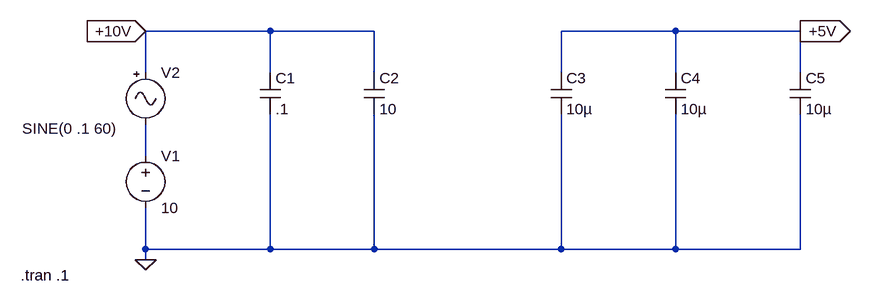
[diagram p0: schematic regulator.asc]
regulator.asc, the LTspice schematic file:
Version 4
SHEET 1 1132 680
WIRE 192 -80 0 -80
WIRE 352 -80 192 -80
WIRE 816 -80 640 -80
WIRE 1008 -80 816 -80
WIRE 0 -16 0 -80
WIRE 192 -16 192 -80
WIRE 352 -16 352 -80
WIRE 640 -16 640 -80
WIRE 816 -16 816 -80
WIRE 1008 -16 1008 -80
WIRE 0 112 0 64
WIRE 0 256 0 192
WIRE 192 256 192 48
WIRE 192 256 0 256
WIRE 352 256 352 48
WIRE 352 256 192 256
WIRE 640 256 640 48
WIRE 640 256 352 256
WIRE 816 256 816 48
WIRE 816 256 640 256
WIRE 1008 256 1008 48
WIRE 1008 256 816 256
WIRE 0 272 0 256
FLAG 0 272 0
FLAG 0 -80 +10V
IOPIN 0 -80 In
FLAG 1008 -80 +5V
IOPIN 1008 -80 Out
SYMBOL voltage 0 96 R0
WINDOW 123 0 0 Left 0
WINDOW 39 0 0 Left 0
SYMATTR InstName V1
SYMATTR Value 10
SYMBOL cap 176 -16 R0
SYMATTR InstName C1
SYMATTR Value .1
SYMBOL cap 336 -16 R0
SYMATTR InstName C2
SYMATTR Value 10
SYMBOL cap 624 -16 R0
SYMATTR InstName C3
SYMATTR Value 10µ
SYMBOL cap 800 -16 R0
SYMATTR InstName C4
SYMATTR Value 10µ
SYMBOL Misc\\signal 0 -32 R0
WINDOW 3 -190 102 Left 2
WINDOW 123 0 0 Left 0
WINDOW 39 0 0 Left 0
SYMATTR InstName V2
SYMATTR Value SINE(0 .1 60)
SYMBOL cap 992 -16 R0
SYMATTR InstName C5
SYMATTR Value 10µ
TEXT -192 296 Left 2 !.tran .1

The netlist it stands for:
* regulator.asc
V1 N001 0 10
C1 +10V 0 .1
C2 +10V 0 10
C3 +5V 0 10µ
C4 +5V 0 10µ
V2 +10V N001 SINE(0 .1 60)
C5 +5V 0 10µ
.tran .1
.backanno
.end

* Results of the author's LTspice run, read from the files saved beside the schematic
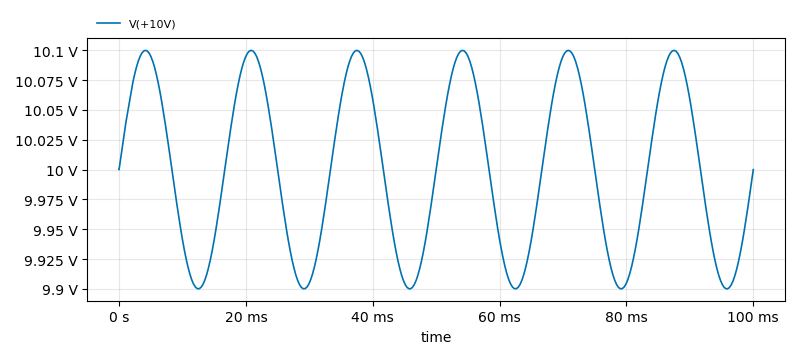
[diagram p1: Transient Analysis of regulator.asc, plotted from the saved traces]
* Transient Analysis, 1 run:
*   V(+10V): min 9.9 V, max 10.1 V, average 10 V, rms 10 V, last 10 V